# Altium project Markovic_Mario.PrjPcb
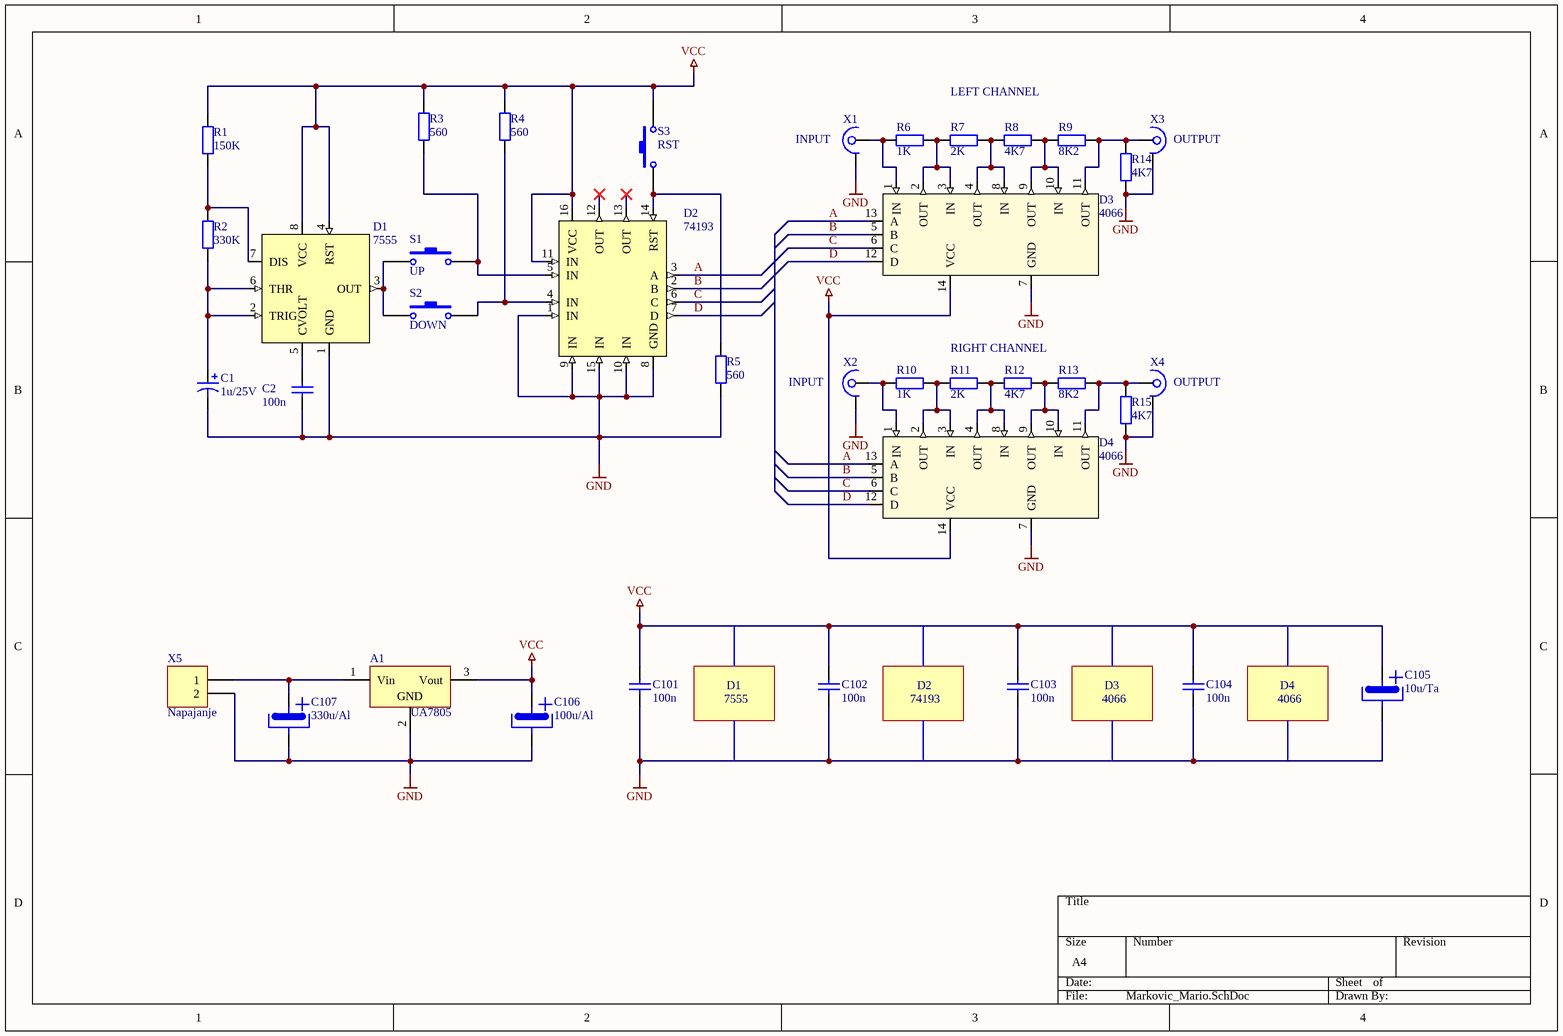
[diagram p0: Markovic_Mario.SchDoc]
1 sheet, 37 parts. Net scope: global (net labels, ports and power ports of the same name join across sheets).
Board file: Markovic_Mario.PcbDoc

## Sheet Markovic_Mario.SchDoc
size A4

### Parts
A1  UA7805  [TO-220AB]
C1  1u/25V  [RB7.6-15]
C2  100n  [RAD-0.3]
C101  100n  [RAD-0.3]
C102  100n  [RAD-0.3]
C103  100n  [RAD-0.3]
C104  100n  [RAD-0.3]
C105  10u/Ta  [RB7.6-15]
C106  100u/Al  [RB7.6-15]
C107  330u/Al  [RB7.6-15]
D1  7555  [DIP-8]
D2  74193  [DIP-16]
D3  4066  [DIP-14]
D4  4066  [DIP-14]
R1  150K  [AXIAL-0.4]
R2  330K  [AXIAL-0.4]
R3  560  [AXIAL-0.4]
R4  560  [AXIAL-0.4]
R5  560  [AXIAL-0.4]
R6  1K  [AXIAL-0.4]
R7  2K  [AXIAL-0.4]
R8  4K7  [AXIAL-0.4]
R9  8K2  [AXIAL-0.4]
R10  1K  [AXIAL-0.4]
R11  2K  [AXIAL-0.4]
R12  4K7  [AXIAL-0.4]
R13  8K2  [AXIAL-0.4]
R14  4K7  [AXIAL-0.4]
R15  4K7  [AXIAL-0.4]
S1  UP  [SWITCH]
S2  DOWN  [SWITCH]
S3  RST  [SWITCH]
X1  INPUT  [JACK]
X2  INPUT  [JACK]
X3  OUTPUT  [JACK]
X4  OUTPUT  [JACK]
X5  Napajanje  [BAT-2]

### Nets
GND: A1.2(GND) C1.2 C2.1 C101.1 C102.1 C103.1 C104.1 C105.2 C106.2 C107.2 D1.1(GND) D2.1(IN) D2.8(GND) D2.9(IN) D2.10(IN) D2.15(IN) D3.7(GND) D4.7(GND) R5.1 R14.1 R15.1 X1.2 X2.2 X3.2 X4.2 X5.2
VCC: A1.3(Vout) C101.2 C102.2 C103.2 C104.2 C105.1 C106.1 D1.4(RST) D1.8(VCC) D2.11(IN) D2.16(VCC) D3.14(VCC) D4.14(VCC) R1.1 R3.2 R4.2 S3.2
A: D2.3(A) D3.13(A) D4.13(A)
B: D2.2(B) D3.5(B) D4.5(B)
C: D2.6(C) D3.6(C) D4.6(C)
D: D2.7(D) D3.12(D) D4.12(D)
NetA1_1: A1.1(Vin) C107.1 X5.1
NetC1_1: C1.1 D1.2(TRIG) D1.6(THR) R2.1
NetC2_2: C2.2 D1.5(CVOLT)
NetD1_3: D1.3(OUT) S1.1 S2.1
NetD1_7: D1.7(DIS) R1.2 R2.2
NetD2_4: D2.4(IN) R4.1 S2.2
NetD2_5: D2.5(IN) R3.1 S1.2
NetD2_14: D2.14(RST) R5.2 S3.1
NetD3_1: D3.1(IN) R6.2 X1.1
NetD3_2: D3.2(OUT) D3.3(IN) R6.1 R7.2
NetD3_4: D3.4(OUT) D3.8(IN) R7.1 R8.2
NetD3_9: D3.9(OUT) D3.10(IN) R8.1 R9.2
NetD3_11: D3.11(OUT) R9.1 R14.2 X3.1
NetD4_1: D4.1(IN) R10.2 X2.1
NetD4_2: D4.2(OUT) D4.3(IN) R10.1 R11.2
NetD4_4: D4.4(OUT) D4.8(IN) R11.1 R12.2
NetD4_9: D4.9(OUT) D4.10(IN) R12.1 R13.2
NetD4_11: D4.11(OUT) R13.1 R15.2 X4.1

Not connected (* = marked no-connect by the designer): D2 12(OUT)* 13(OUT)*

### Notes on the sheet
- LEFT CHANNEL
- RIGHT CHANNEL
- 7555
- D1
- 74193
- D2
- 4066
- D3
- D4

### Library data of the parts
A1 = Volt Reg: Voltage Regulator; Proizvođač: TEXAS INSTRUMENTS; Opis komponente: Linear Voltage Regulator, 7805, Fixed, 7V To 25V In, 5V And 1.5A Out; Katalog dobavljača: Farnell; Kataloški broj: 2075448; Cijena: 4.68 kn; PackageReference: D2PAK
C1 = Cap Pol1: Polarized Capacitor (Radial); Value: 1u; Proizvođač: VISHAY; Opis komponente: CERAMIC CAPACITOR, 1UF, 25V, Y5V, +80,-20%, RADIAL; Katalog dobavljača: Farnell; Kataloški broj: 3322208; Cijena: 2.73 kn; PackageReference: RB7.6-15
C2 C101-C104 = Cap: Capacitor; Proizvođač: KEMET; Opis komponente: Multilayer Ceramic Capacitor, Gold Max, 0.1 µF, 50 V, Goldmax, 300 Series, ± 10%, Radial Leaded; Katalog dobavljača: Farnell; Kataloški broj: 1457699; Cijena: 2.06 kn; PackageReference: RAD-0.3; Value: 100n
C105 = Elektrolitski kondenzator: Value: 10u; Proizvođač: MULTICOMP; Opis komponente: Tantalum Capacitor, Epoxy-Coated, 10 µF, 6.3 V, MCCB Series, ± 20%, Radial Leaded, 5.1 mm; Katalog dobavljača: Farnell; Kataloški broj: 9708200; Cijena: 5.35 kn
C106 = Elektrolitski kondenzator: Value: 100u; Proizvođač: KEMET; Opis komponente: SMD Aluminium Electrolytic Capacitor, Radial Can - SMD, 100 µF, 16 V, EDK Series; Katalog dobavljača: Farnell; Kataloški broj: 2068653; Cijena: 1.77 kn
C107 = Elektrolitski kondenzator: Value: 330u; Cijena: 5.25 kn; Katalog dobavljača: Farnell; Kataloški broj: 9695796; Opis komponente: SMD Aluminium Electrolytic Capacitor, Radial Can - SMD, 330 µF, 25 V, FK Series; Proizvođač: PANASONIC
D1 = 7555: Cijena: 7.05 kn; Katalog dobavljača: Farnell; Kataloški broj: 1564692; Opis komponente: Timer, Oscillator & Pulse Generator IC; Proizvođač: TEXAS INSTRUMENTS
D2 = 74193: Cijena: 3.14 kn; Katalog dobavljača: Farnell; Kataloški broj: 1470793; Opis komponente: Binary Synchronous Up / Down Counter; Proizvođač: TEXAS INSTRUMENTS
D3 D4 = 4066: Cijena: 3.51 kn; Katalog dobavljača: Farnell; Kataloški broj: 2136906; Opis komponente: ANALOG SWITCH; Proizvođač: TEXAS INSTRUMENTS
R1 = Res2: Resistor; Proizvođač: MULTICOMP; Opis komponente: Through Hole Resistor, 150 kohm, MF25 Series, 250 mW, ± 1%, Axial Leaded, 250 V; Katalog dobavljača: Farnell; Kataloški broj: 9341340; Cijena: 0.26 kn; PackageReference: AXIAL-0.4; Value: 150K
R2 = Res2: Resistor; Proizvođač: MULTICOMP; Opis komponente: Through Hole Resistor, 330 kohm, MF25 Series, 250 mW, ± 1%, Axial Leaded, 250 V; Katalog dobavljača: Farnell; Kataloški broj: 9341765; Cijena: 0.26 kn; PackageReference: AXIAL-0.4; Value: 330K
R3-R5 = Res2: Resistor; Proizvođač: MULTICOMP; Opis komponente: Through Hole Resistor, 560 ohm, MF25 Series, 250 mW, ± 1%, Axial Leaded, 250 V; Katalog dobavljača: Farnell; Kataloški broj: 9342052; Cijena: 0.26 kn; PackageReference: AXIAL-0.4; Value: 560
R6 R10 = Res2: Resistor; Proizvođač: MULTICOMP; Opis komponente: Through Hole Resistor, 1 kohm, MF25 Series, 250 mW, ± 1%, Axial Leaded, 250 V; Katalog dobavljača: Farnell; Kataloški broj: 9341102; Cijena: 0.26 kn; PackageReference: AXIAL-0.4; Value: 1K
R7 R11 = Res2: Resistor; Proizvođač: MULTICOMP; Opis komponente: Through Hole Resistor, 2 kohm, MF25 Series, 250 mW, ± 1%, Axial Leaded, 250 V; Katalog dobavljača: Farnell; Kataloški broj: 9341480; Cijena: 0.26 kn; PackageReference: AXIAL-0.4; Value: 2K
R8 R12 R14 R15 = Res2: Resistor; Proizvođač: MULTICOMP; Opis komponente: Through Hole Resistor, 4.7 kohm, MF25 Series, 250 mW, ± 1%, Axial Leaded, 250 V; Katalog dobavljača: Farnell; Kataloški broj: 9341951; Cijena: 0.26 kn; PackageReference: AXIAL-0.4; Value: 4K7
R9 R13 = Res2: Resistor; Proizvođač: MULTICOMP; Opis komponente: Through Hole Resistor, 8.2 kohm, MF25 Series, 250 mW, ± 1%, Axial Leaded, 250 V; Katalog dobavljača: Farnell; Kataloški broj: 9342273; Cijena: 0.26 kn; PackageReference: AXIAL-0.4; Value: 8K2
S1-S3 = SW-PB: Switch; Proizvođač: MULTICOMP; Opis komponente: Tactile Switch, MCDTS6 Series, Top Actuated, Through Hole, Round Button, 160 gf, 50mA at 12VDC; Katalog dobavljača: Farnell; Kataloški broj: 9471731; Cijena: 1.21 kn; PackageReference: SPST-2
X1-X4 = Konektor: Proizvođač: CLIFF ELECTRONIC COMPONENTS; Opis komponente: RCA (Phono) Audio / Video Connector, PCB, 1 Position, 2 Contacts, Jack; Katalog dobavljača: Farnell; Kataloški broj: 2817595; Cijena: 4.41 kn
X5 = Header 2: Header, 2-Pin; Proizvođač: BUCHANAN - TE CONNECTIVITY; Opis komponente: Wire-To-Board Terminal Block, 2.54 mm, 2 Ways, 30 AWG, 16 AWG, 1.4 mm²; Katalog dobavljača: Farnell; Kataloški broj: 2112482; Cijena: 4.53 kn